# Altium schematic sheet MB1296-Connectors.SchDoc: Connectors
size A4; Date: 25-JAN-2017; Organization: STMicroelectronics; Address1: Microcontrollers Division; Address2: 190, avenue Célestin COQ; Address3: 13106 ROUSSET Cedex; Address4: FRANCE; DocumentNumber: MB1296; Revision: D-01; SheetNumber: 6; SheetTotal: 6; Project: STM32 LoRa Discovery
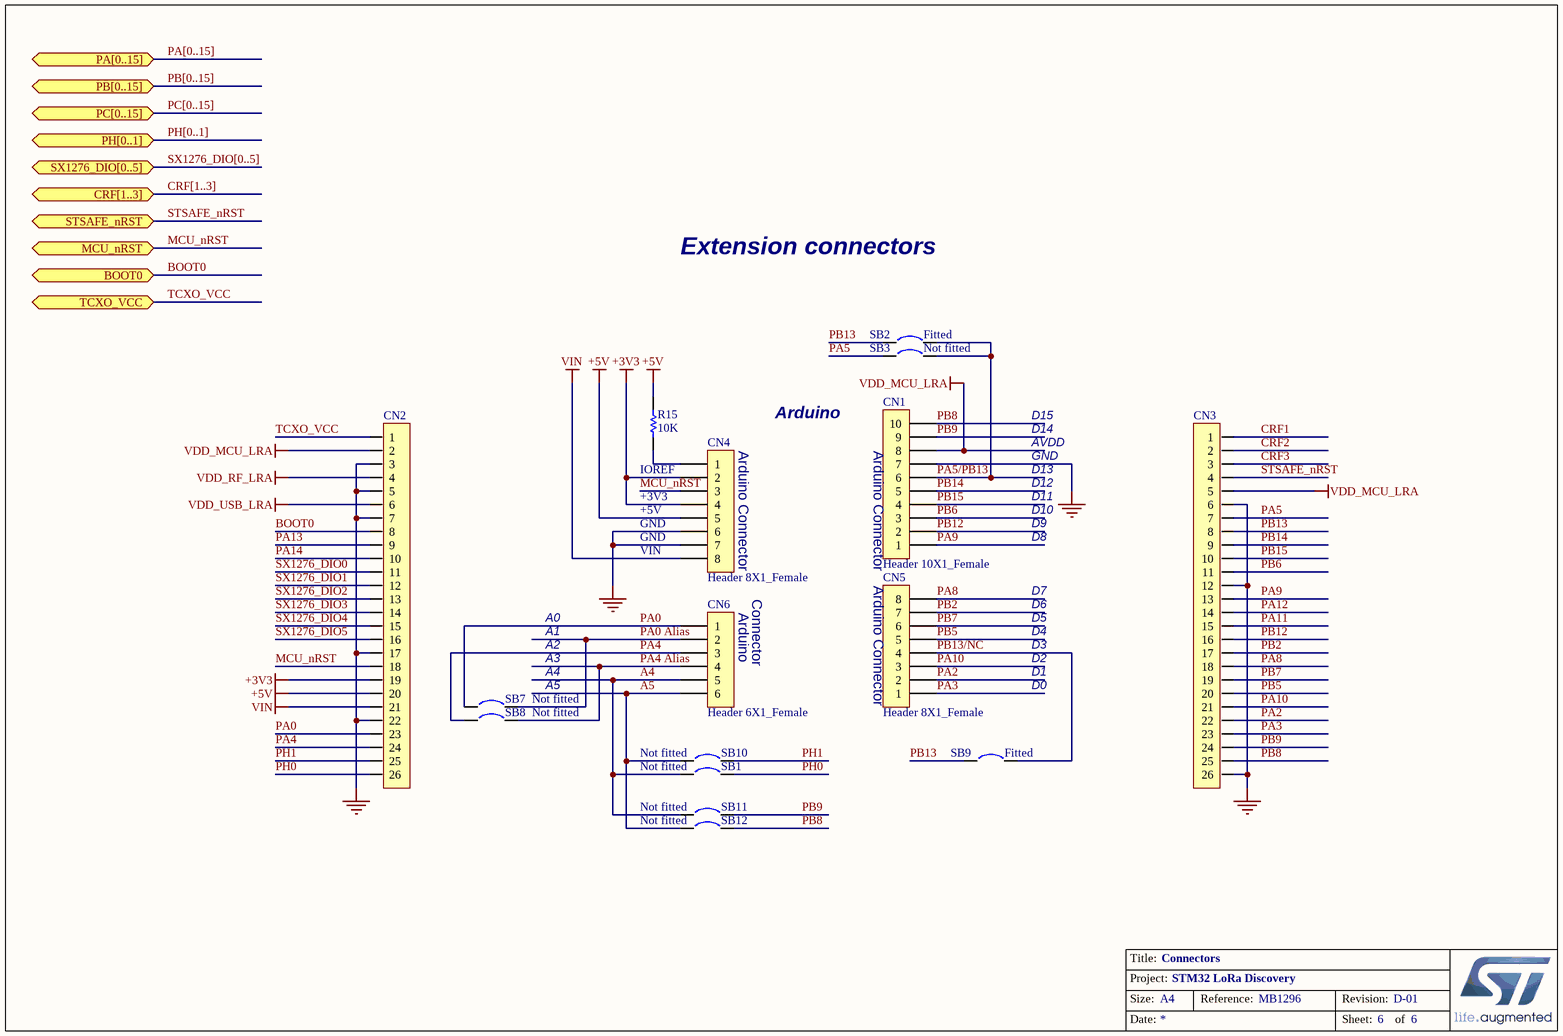
[diagram p0: MB1296-Connectors.SchDoc]

## Parts
CN1  Header 10X1_Female  [Header 1x10 Female (Wrapping)]
CN2  (no value)  [HEADER 1X26 (2.54) Male]
CN3  (no value)  [HEADER 1X26 (2.54) Male]
CN4  Header 8X1_Female  [Header 1x8Female (Wrapping)]
CN5  Header 8X1_Female  [Header 1x8Female (Wrapping)]
CN6  Header 6X1_Female  [Header 1x6 Female (Wrapping)]
R15  10K  [0603R]
SB1  Circuit Breaker  [JP2_SMD]  (value not drawn)
SB2  Circuit Breaker  [JP2_SMD]  (value not drawn)
SB3  Circuit Breaker  [JP2_SMD]  (value not drawn)
SB7  Circuit Breaker  [JP2_SMD]  (value not drawn)
SB8  Circuit Breaker  [JP2_SMD]  (value not drawn)
SB9  Circuit Breaker  [JP2_SMD]  (value not drawn)
SB10  Circuit Breaker  [JP2_SMD]  (value not drawn)
SB11  Circuit Breaker  [JP2_SMD]  (value not drawn)
SB12  Circuit Breaker  [JP2_SMD]  (value not drawn)

## Ports
BOOT0, CRF[1..3], MCU_nRST, PA[0..15] (bidir), PB[0..15] (bidir), PC[0..15] (bidir), PH[0..1] (bidir), STSAFE_nRST, SX1276_DIO[0..5] (bidir), TCXO_VCC

## Nets
+3V3: CN2.19 CN4.2 CN4.4
+5V: CN2.20 CN4.5 R15.1
GND: CN1.7 CN2.3 CN2.5 CN2.7 CN2.17 CN2.22 CN3.6 CN3.12 CN3.26 CN4.6 CN4.7
VDD_MCU_LRA: CN1.8 CN2.2 CN3.5
VDD_RF_LRA: CN2.4
VDD_USB_LRA: CN2.6
VIN: CN2.21 CN4.8
A4: CN6.5 SB1.1 SB11.1
A5: CN6.6 SB10.1 SB12.1
BOOT0: CN2.8 ; port BOOT0
CRF1: CN3.1
CRF2: CN3.2
CRF3: CN3.3
MCU_nRST: CN2.18 CN4.3 ; port MCU_nRST
PA0: CN2.23 CN6.1 SB7.1
PA0 Alias: CN6.2 SB7.2
PA2: CN3.22 CN5.2
PA3: CN3.23 CN5.1
PA4: CN2.24 CN6.3 SB8.1
PA4 Alias: CN6.4 SB8.2
PA5: CN3.7 SB3.1
PA5/PB13: CN1.6 SB2.2 SB3.2
PA8: CN3.18 CN5.8
PA9: CN1.1 CN3.13
PA10: CN3.21 CN5.3
PA11: CN3.15
PA12: CN3.14
PA13: CN2.9
PA14: CN2.10
PB2: CN3.17 CN5.7
PB5: CN3.20 CN5.5
PB6: CN1.3 CN3.11
PB7: CN3.19 CN5.6
PB8: CN1.10 CN3.25 SB12.2
PB9: CN1.9 CN3.24 SB11.2
PB12: CN1.2 CN3.16
PB13: CN3.8 SB2.1 SB9.1
PB13/NC: CN5.4 SB9.2
PB14: CN1.5 CN3.9
PB15: CN1.4 CN3.10
PH0: CN2.26 SB1.2
PH1: CN2.25 SB10.2
STSAFE_nRST: CN3.4 ; port STSAFE_nRST
SX1276_DIO0: CN2.11
SX1276_DIO1: CN2.12
SX1276_DIO2: CN2.13
SX1276_DIO3: CN2.14
SX1276_DIO4: CN2.15
SX1276_DIO5: CN2.16
TCXO_VCC: CN2.1 ; port TCXO_VCC
NetCN4_1: CN4.1 R15.2

## Buses and harness runs
bus CRF[1..3] = port CRF[1..3]
bus PA[0..15] = port PA[0..15]
bus PB[0..15] = port PB[0..15]
bus PC[0..15] = port PC[0..15]
bus PH[0..1] = port PH[0..1]
bus SX1276_DIO[0..5] = port SX1276_DIO[0..5]

## Notes on the sheet
- Extension connectors
- (near SB2) Fitted
- Not fitted
- (near CN4) Arduino Connector
- Arduino
- Arduino Connector
- D14
- D15
- AVDD
- IOREF
- +3V3
- +5V
- D10
- D13
- D12
- D11
- GND
- (near CN4) GND
- (near CN4) VIN
- (near CN5) Arduino Connector
- D8
- D9
- A0
- A1
- A2
- (near CN6) Arduino
- Connector
- D4
- D3
- D5
- D6
- D7
- A3
- A4
- A5
- D0
- D1
- D2
- (near SB10) Not fitted
- (near SB9) Fitted
- (near SB11) Not fitted
- Title:
- Project:
- Size:
- Date:
- Reference:
- Sheet:
- Revision:
- of

## Library data of the parts
CN1 = Header 10X1_Female: Header, 10-Pin, Single row,female; Manufacturer: Lyconn; Manufacturer P/N: 218110S1610; Provided by: Subcon; ECCN_US/UE: *; Fitted: *; Order Code Digikey: *; Order Code Farnell: *; Order Code RS: *; Value: *
CN2 CN3 = CON_SLW-126-01-T-S: Connector header 26x1 2.54mm female; Manufacturer: Samtec; Manufacturer P/N: MTSW-126-22-T-S-265; Fitted: Yes
CN4 CN5 = Header 8X1_Female: Header, 8-Pin, Single row,female; Manufacturer: Lyconn; Manufacturer P/N: 218108S1610; Provided by: Subcon; ECCN_US/UE: *; Fitted: *; Order Code Digikey: *; Order Code Farnell: *; Order Code RS: *; Value: *
CN6 = Header 6X1_Female: Header, 6-Pin, Single row,female; Manufacturer: Lyconn; Manufacturer P/N: 218106S1610; Provided by: Subcon; ECCN_US/UE: *; Fitted: *; Order Code Digikey: *; Order Code Farnell: *; Order Code RS: *; Value: *
R15 = Resistor_ST: Resistor 0603; Manufacturer: YAGEO; Manufacturer P/N: RC0603JR-0710KL; Provided by: Subcon; Value: 10K; ECCN_US/UE: *; Fitted: *; Order Code Digikey: *; Order Code Farnell: *; Order Code RS: *
SB1 SB2 SB7 SB8 SB10-SB12 = Circuit Breaker: Fitted: No; Revision: July-2002: Re-released for DXP Platform.; ECCN_US/UE: *; Manufacturer: *; Manufacturer P/N: *; Order Code Digikey: *; Order Code Farnell: *; Order Code RS: *; Provided by: *; Value: *
SB3 SB9 = Circuit Breaker: Fitted: Yes; Revision: July-2002: Re-released for DXP Platform.; ECCN_US/UE: *; Manufacturer: *; Manufacturer P/N: *; Order Code Digikey: *; Order Code Farnell: *; Order Code RS: *; Provided by: *; Value: *